# EasyEDA schematic SCH_Tap-Touch-ESP32_2025-01-30.json
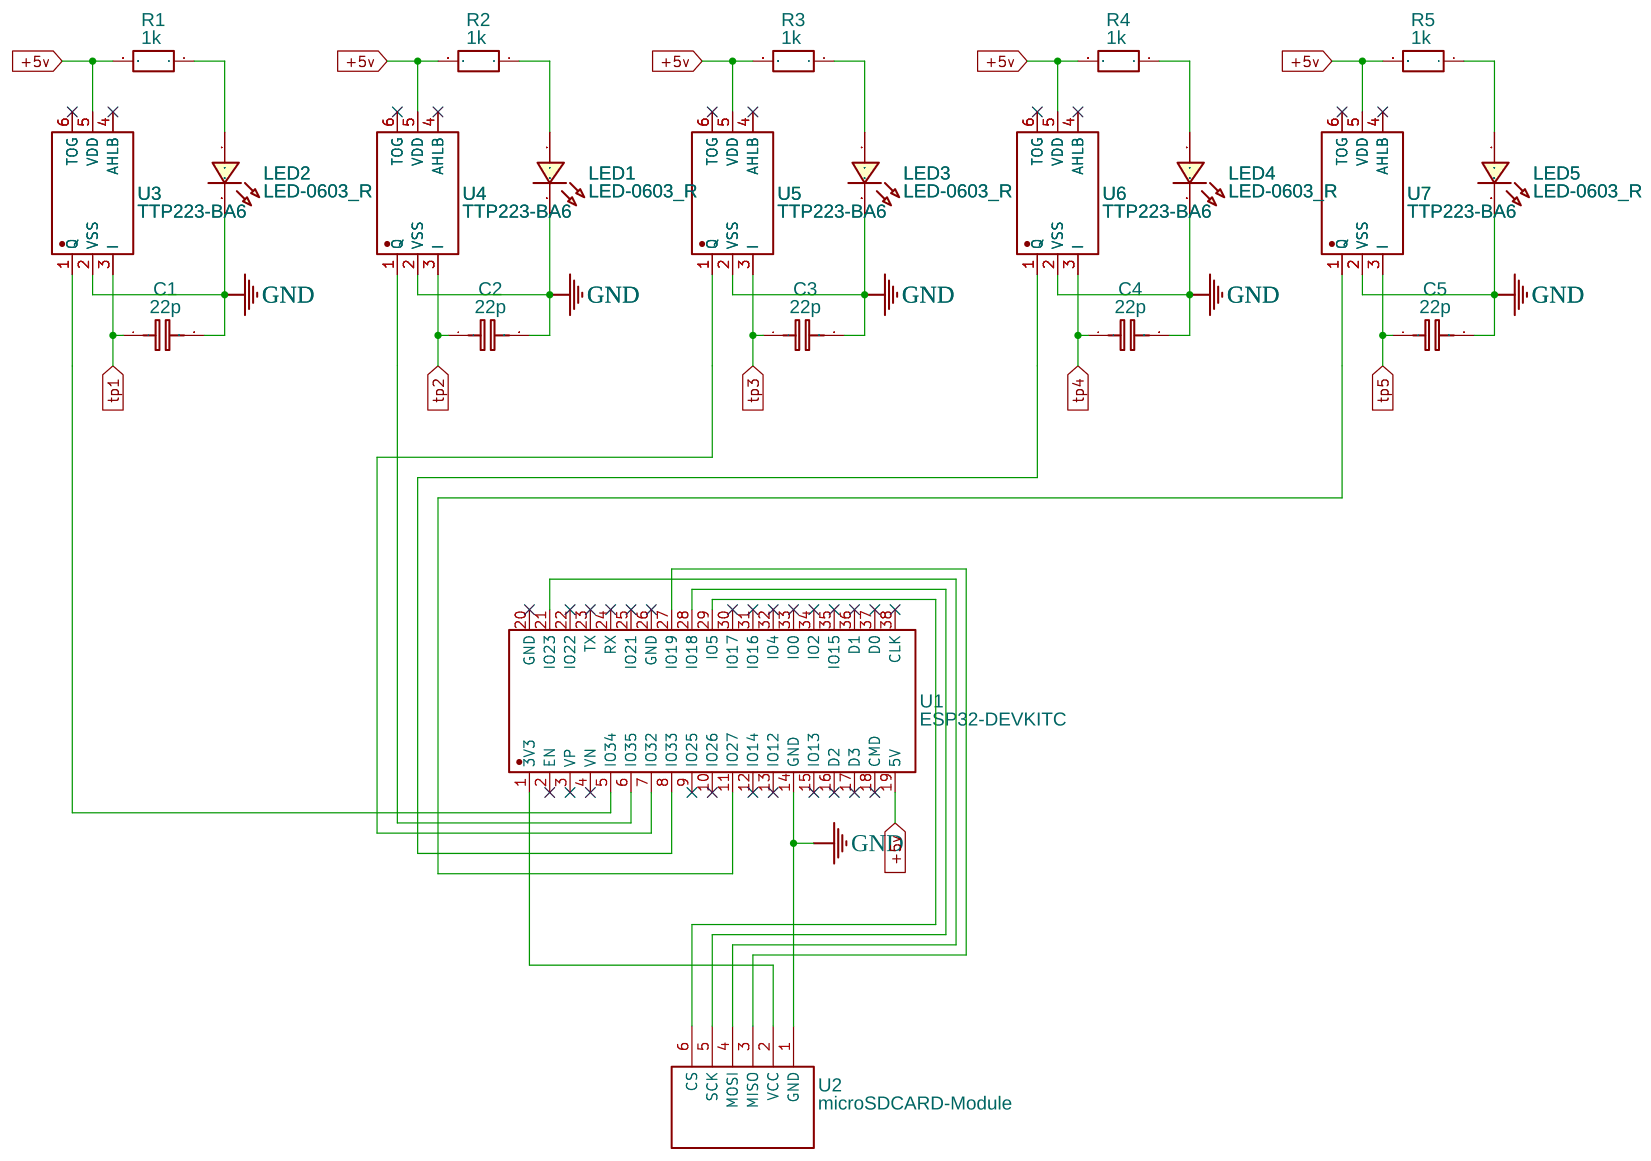
[diagram p0: schematic sheet]

## Parts
C1  22p  [C0603]
C2  22p  [C0603]
C3  22p  [C0603]
C4  22p  [C0603]
C5  22p  [C0603]
LED1  LED-0603_R  [LED0603_RED]
LED2  LED-0603_R  [LED0603_RED]
LED3  LED-0603_R  [LED0603_RED]
LED4  LED-0603_R  [LED0603_RED]
LED5  LED-0603_R  [LED0603_RED]
R1  1k  [R0603]
R2  1k  [R0603]
R3  1k  [R0603]
R4  1k  [R0603]
R5  1k  [R0603]
U1  ESP32-DEVKITC  [BULETM-SMD_ESP32-DEVKITC]
U2  microSDCARD-Module  [MICRO-SDCARD-MODULE]
U3  TTP223-BA6  [SOT-23-6_L2.9-W1.6-P0.95-LS2.8-BR]
U4  TTP223-BA6  [SOT-23-6_L2.9-W1.6-P0.95-LS2.8-BR]
U5  TTP223-BA6  [SOT-23-6_L2.9-W1.6-P0.95-LS2.8-BR]
U6  TTP223-BA6  [SOT-23-6_L2.9-W1.6-P0.95-LS2.8-BR]
U7  TTP223-BA6  [SOT-23-6_L2.9-W1.6-P0.95-LS2.8-BR]

## Library data of the parts
C1-C5 = C_0603_EU: Contributor: LCEDA_Lib
LED1-LED5 = LED-0603_R: Manufacturer: EVERLIGHT(台湾亿光); Manufacturer Part: 19-217/R6C-AL1M2VY/3T; Supplier Part: C72044; Supplier: LCSC; Contributor: LCEDA_01
R1-R5 = R_0603_EU: Contributor: LCEDA_Lib
U1 = ESP32-DEVKITC: Supplier: LCSC; Supplier Part: C571180; Manufacturer: ESPRESSIF(乐鑫); Manufacturer Part: ESP32-DevKitC; Contributor: lcsc; JLCPCB Part Class: Extended Part
U2 = microSDCARD-Module: Contributor: m.raafat.irobotic
U3-U7 = TTP223-BA6_C2757936: Contributor: LCSC; Supplier: LCSC; Supplier Part: C2757936; Manufacturer: TONTEK(通泰); JLCPCB Part Class: Extended Part

## Nets
+5v: R1.2 R2.2 R3.2 R4.2 R5.2 U1.19(5V) U3.5(VDD) U4.5(VDD) U5.5(VDD) U6.5(VDD) U7.5(VDD)
GND: C1.2 C2.2 C3.2 C4.2 C5.2 LED1.2 LED2.2 LED3.2 LED4.2 LED5.2 U1.14(GND) U2.1(GND) U3.2(VSS) U4.2(VSS) U5.2(VSS) U6.2(VSS) U7.2(VSS)
tp1: C1.1 U3.3(I)
tp2: C2.1 U4.3(I)
tp3: C3.1 U5.3(I)
tp4: C4.1 U6.3(I)
tp5: C5.1 U7.3(I)
Net-(LED1-1): LED1.1 R2.1
Net-(LED2-1): LED2.1 R1.1
Net-(LED3-1): LED3.1 R3.1
Net-(LED4-1): LED4.1 R4.1
Net-(LED5-1): LED5.1 R5.1
Net-(U1-1): U1.1(3V3) U2.2(VCC)
Net-(U1-5): U1.5(IO34) U3.1(Q)
Net-(U1-6): U1.6(IO35) U4.1(Q)
Net-(U1-7): U1.7(IO32) U5.1(Q)
Net-(U1-8): U1.8(IO33) U6.1(Q)
Net-(U1-11): U1.11(IO27) U7.1(Q)
Net-(U1-21): U1.21(IO23) U2.4(MOSI)
Net-(U1-27): U1.27(IO19) U2.3(MISO)
Net-(U1-28): U1.28(IO18) U2.5(SCK)
Net-(U1-29): U1.29(IO5) U2.6(CS)

Not connected (* = marked no-connect by the designer): U1 2(EN)* 3(VP)* 4(VN)* 9(IO25)* 10(IO26)* 12(IO14)* 13(IO12)* 15(IO13)* 16(D2)* 17(D3)* 18(CMD)* 20(GND)* 22(IO22)* 23(TX)* 24(RX)* 25(IO21)* 26(GND)* 30(IO17)* 31(IO16)* 32(IO4)* 33(IO0)* 34(IO2)* 35(IO15)* 36(D1)* 37(D0)* 38(CLK)*; U3 4(AHLB)* 6(TOG)*; U4 4(AHLB)* 6(TOG)*; U5 4(AHLB)* 6(TOG)*; U6 4(AHLB)* 6(TOG)*; U7 4(AHLB)* 6(TOG)*
